# EAGLE design MK12 (EAGLE 9.0.1)

## Sheet 1 of 2
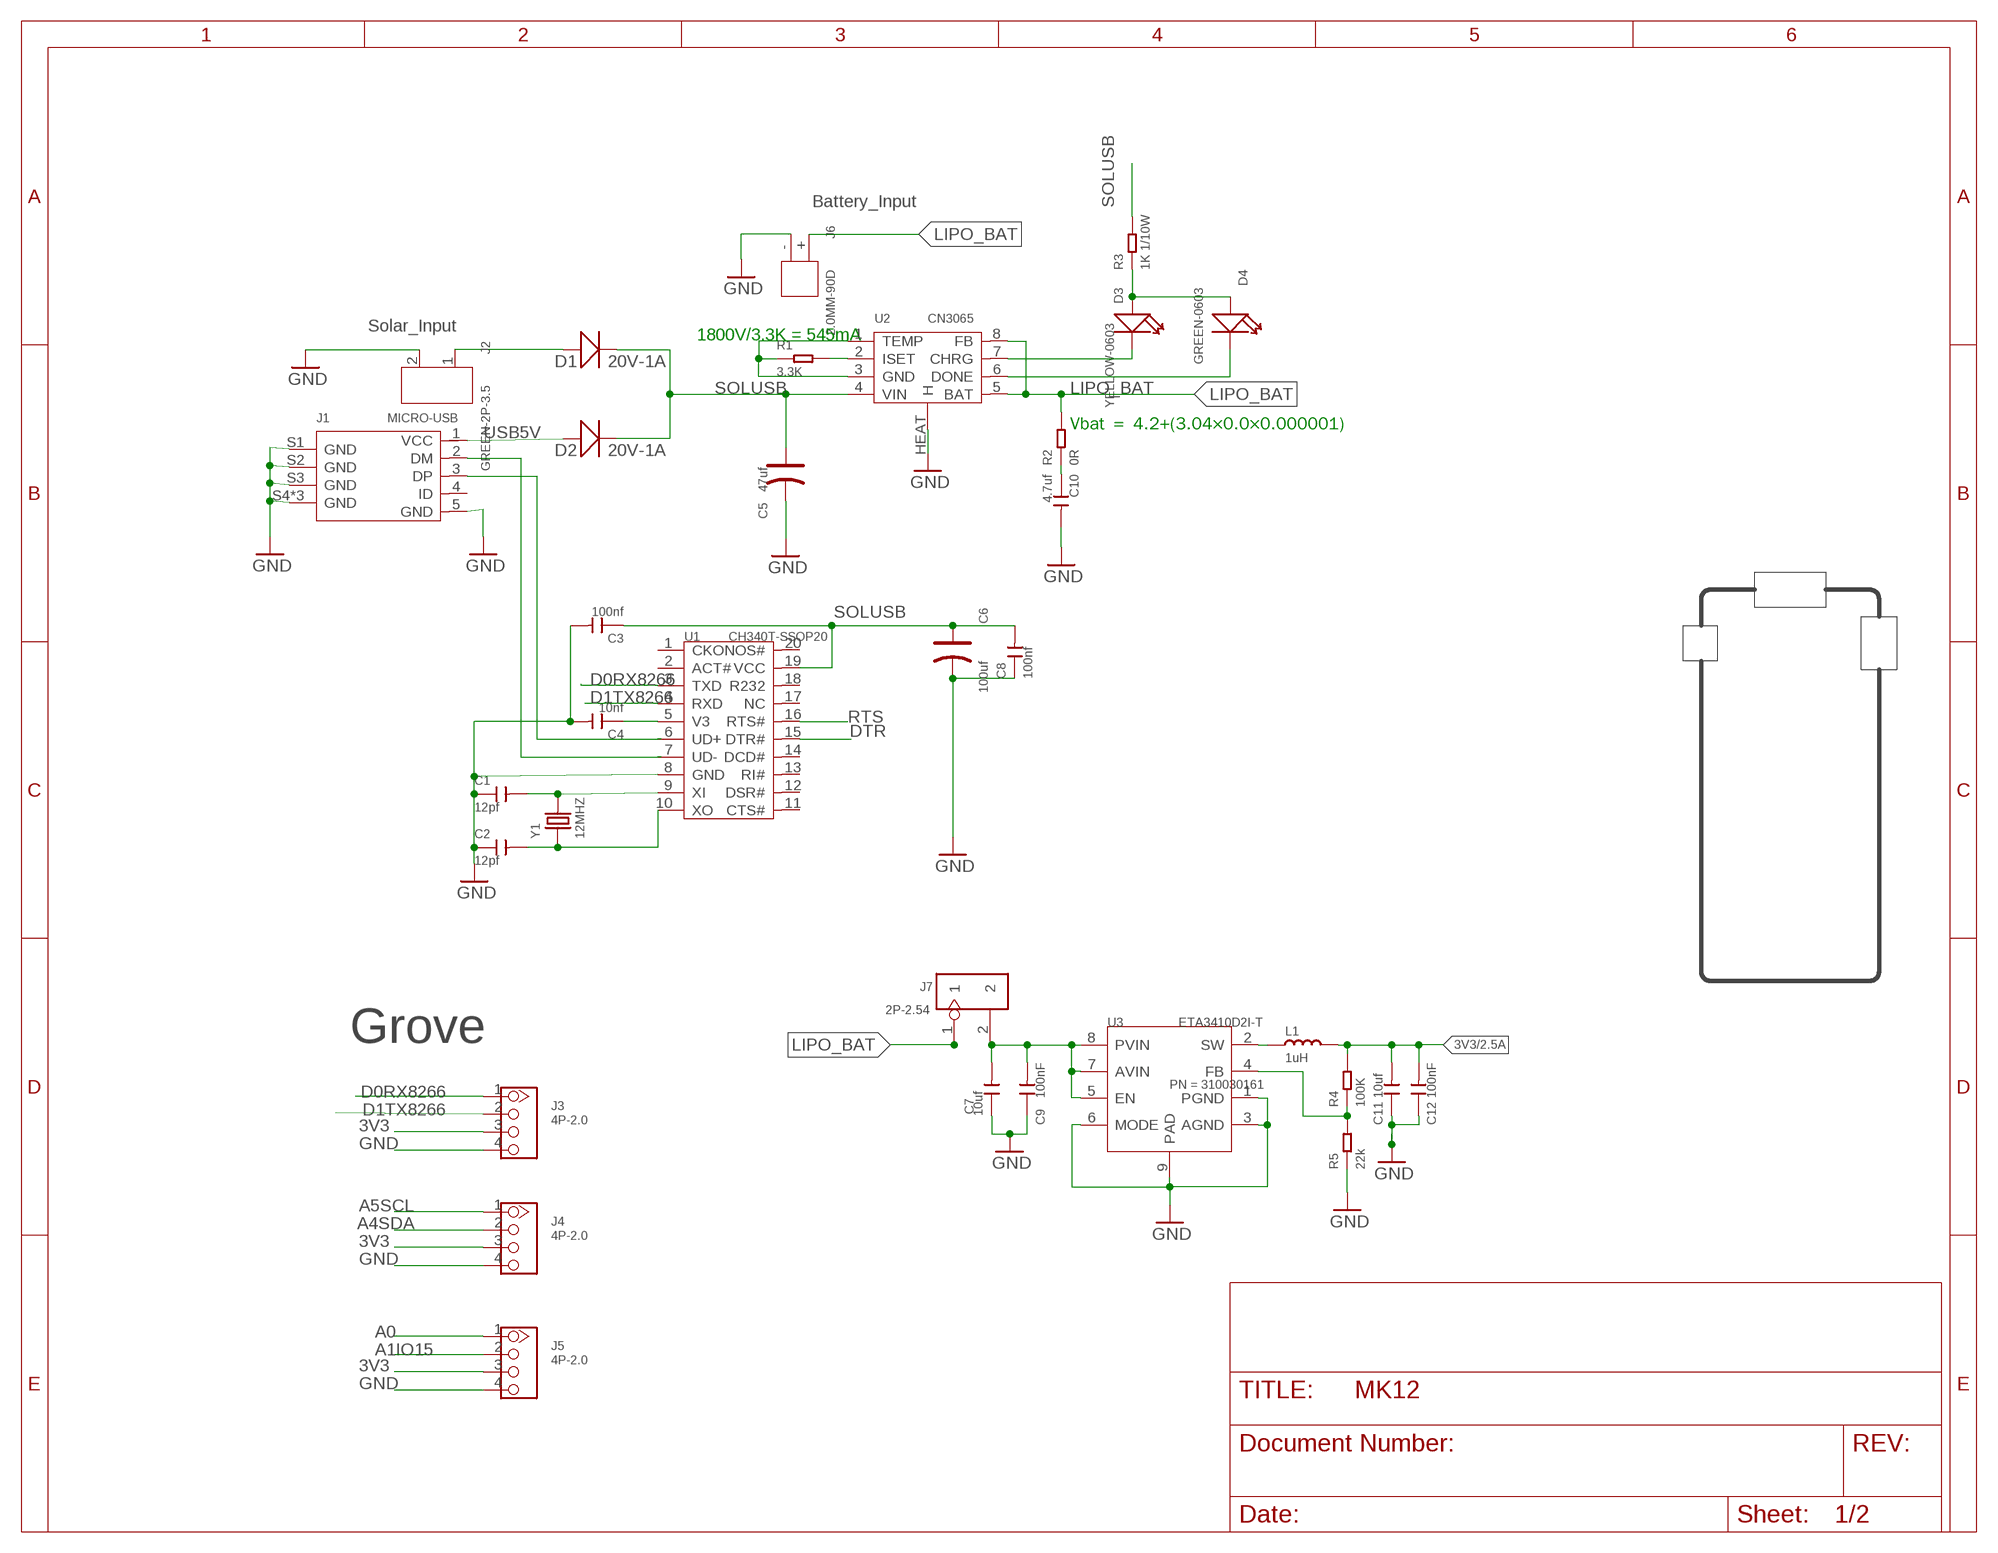
[diagram p0: schematic, sheet 1]

### Parts
C1  12pf  CERAMIC-12PF-50V-5%-NPO(0402)  [C0402]
C2  12pf  CERAMIC-12PF-50V-5%-NPO(0402)  [C0402]
C3  100nf  CERAMIC-100NF-50V-10%-X7R(0603)  [C0603]
C4  10nf  CERAMIC-10NF-50V-10%-X7R(0603)  [C0603]
C5  47uf  TANTALUM-SMD-47UF-6.3V(AVX-A)  [AVX-A]
C6  100uf  TANTALUM-SMD-100UF-10V(AVX-B)  [AVX-B]
C7  10uf  CERAMIC-10UF-25V-10%-X5R(0805)  [C0805]
C8  100nf  CERAMIC-100NF-50V-10%-X7R(0603)  [C0603]
C9  100nF  CAP-0402  [C0402]
C10  4.7uf  CERAMIC-4.7UF-10V-10%-X5R(0603)  [C0603]
C11  10uf  CERAMIC-10UF-25V-10%-X5R(0805)  [C0805]
C12  100nF  CAP-0402  [C0402]
D1  20V-1A  SMD-DIODE-SCHOTTKY-20V-1A(SOD-123)  [SOD-123]
D2  20V-1A  SMD-DIODE-SCHOTTKY-20V-1A(SOD-123)  [SOD-123]
D3  YELLOW-0603  SMD-LED-CLEAR-YELLOW(0603)  [LED-0603]
D4  GREEN-0603  SMD-LED-CLEAR-GREEN(0603)  [LED-0603]
J1  MICRO-USB  MICRO-USB5+4P'5+4P'  [MICRO-USB5+4P-SMD-0.65-B]
J2  GREEN-2P-3.5  SCREW-TERMINAL-GREEN(2P-3.5)  [H2-3.5-7.0X7.0MM]
J3  4P-2.0  GROVE-CONNECTOR-DIP(4P-2.0)  [HW4-2.0]
J4  4P-2.0  GROVE-CONNECTOR-DIP(4P-2.0)  [HW4-2.0]
J5  4P-2.0  GROVE-CONNECTOR-DIP(4P-2.0)  [HW4-2.0]
J6  2.0MM-90D  CONN-HEADER-PH-SIDE-(2P-2.0MM)'90D'  [H2-2.0-90D]
J7  2P-2.54  DIP-WHITE-MALE-HEADER-VERT(2P-2.54)  [H2-2.54]
L1  1uH  INDUCTOR/FERRITE-BEAD'0603'  [L0603]
R1  3.3K  SMD-RES-3.3K-5%-1/10W(0603)  [R0603]
R2  0R  SMD-RES-0R-5%-1/10W(0603)  [R0603]
R3  1K 1/10W  SMD-RES-1K-5%-1/10W(0603)  [R0603]
R4  100K  SMD-RES-100K-1%-1/16W(0402)  [R0402]
R5  22k  SMD-RES-22K-1%-1/16W(0402)  [R0402]
U1  CH340T-SSOP20  INTERFACE-CH340T(SSOP20)  [SSOP20-0.65-7.6X5.2MM]
U2  CN3065  PMIC-CN3065-DFN8  [DFN-8]
U3  ETA3410D2I-T  CONVERTER-ETA3410  [DFN8G-0.5-2X2MM]
Y1  12MHZ  SMD-CRYSTAL-12MHZ-20PF-20PPM-40R(2P-5.0X3.2MM)  [X2-SMD-5.0X3.2X1.3MM]

### Nets
3V3 [POWER]: C11.2 C12.2 J3.3 J4.3 J5.3 L1.2 R4.2 ; also sheet 2
A0: J5.1 ; also sheet 2
A1IO15: J5.2 ; also sheet 2
A4SDA: J4.2 ; also sheet 2
A5SCL: J4.1 ; also sheet 2
BAT_3V3_IN [POWER]: C7.2 C9.2 J7.2 U3.5(EN) U3.7(AVIN) U3.8(PVIN)
D0RX8266: J3.1 U1.3(TXD) ; also sheet 2
D1TX8266: J3.2 U1.4(RXD) ; also sheet 2
DTR: U1.15(DTR#) ; also sheet 2
GND [POWER]: C1.1 C2.1 C3.2 C4.2 C5.- C6.- C7.1 C8.1 C9.1 C10.2 C11.1 C12.1 J1.5(GND) J1.S1(GND) J1.S2(GND) J1.S3(GND) J1.S4(GND) J1.S5(GND) J1.S6(GND) J2.2 J3.4 J4.4 J5.4 J6.- R1.1 R5.1 U1.8(GND) U2.1(TEMP) U2.3(GND) U2.HEAT(H) U3.1(PGND) U3.3(AGND) U3.6(MODE) U3.9(PAD) ; also sheet 2
LIPO_BAT [POWER]: J6.+ J7.1 R2.2 U2.5(BAT) U2.8(FB)
N$2: D3.+ D4.+ R3.1
N$3: L1.1 U3.2(SW)
N$4: R4.1 R5.2 U3.4(FB)
N$5 [POWER]: C1.2 U1.9(XI) Y1.2
N$6 [POWER]: C2.2 U1.10(XO) Y1.1
N$7: R1.2 U2.2(ISET)
N$8: D3.- U2.7(CHRG)
N$9: J1.2(DM) U1.7(UD-)
N$10: C10.1 R2.1
N$11: J1.3(DP) U1.6(UD+)
N$12: D4.- U2.6(DONE)
RTS: U1.16(RTS#) ; also sheet 2
SOLAR [VUSB]: D1.+ J2.1
SOLUSB [POWER]: C3.1 C5.+ C6.+ C8.2 D1.- D2.- R3.2 U1.19(VCC) U2.4(VIN)
USB5V [VUSB]: D2.+ J1.1(VCC)
V3: C4.1 U1.5(V3)
Unconnected: J1.4(ID) U1.1(CKO) U1.2(ACT#) U1.11(CTS#) U1.12(DSR#) U1.13(RI#) U1.14(DCD#) U1.17(NC) U1.18(R232) U1.20(NOS#)

### Notes on the sheet
- Battery_Input
- Solar_Input
- 1800V/3.3K = 545mA
- Vbat ＝ 4.2+(3.04×0.0×0.000001)
- Grove

## Sheet 2 of 2
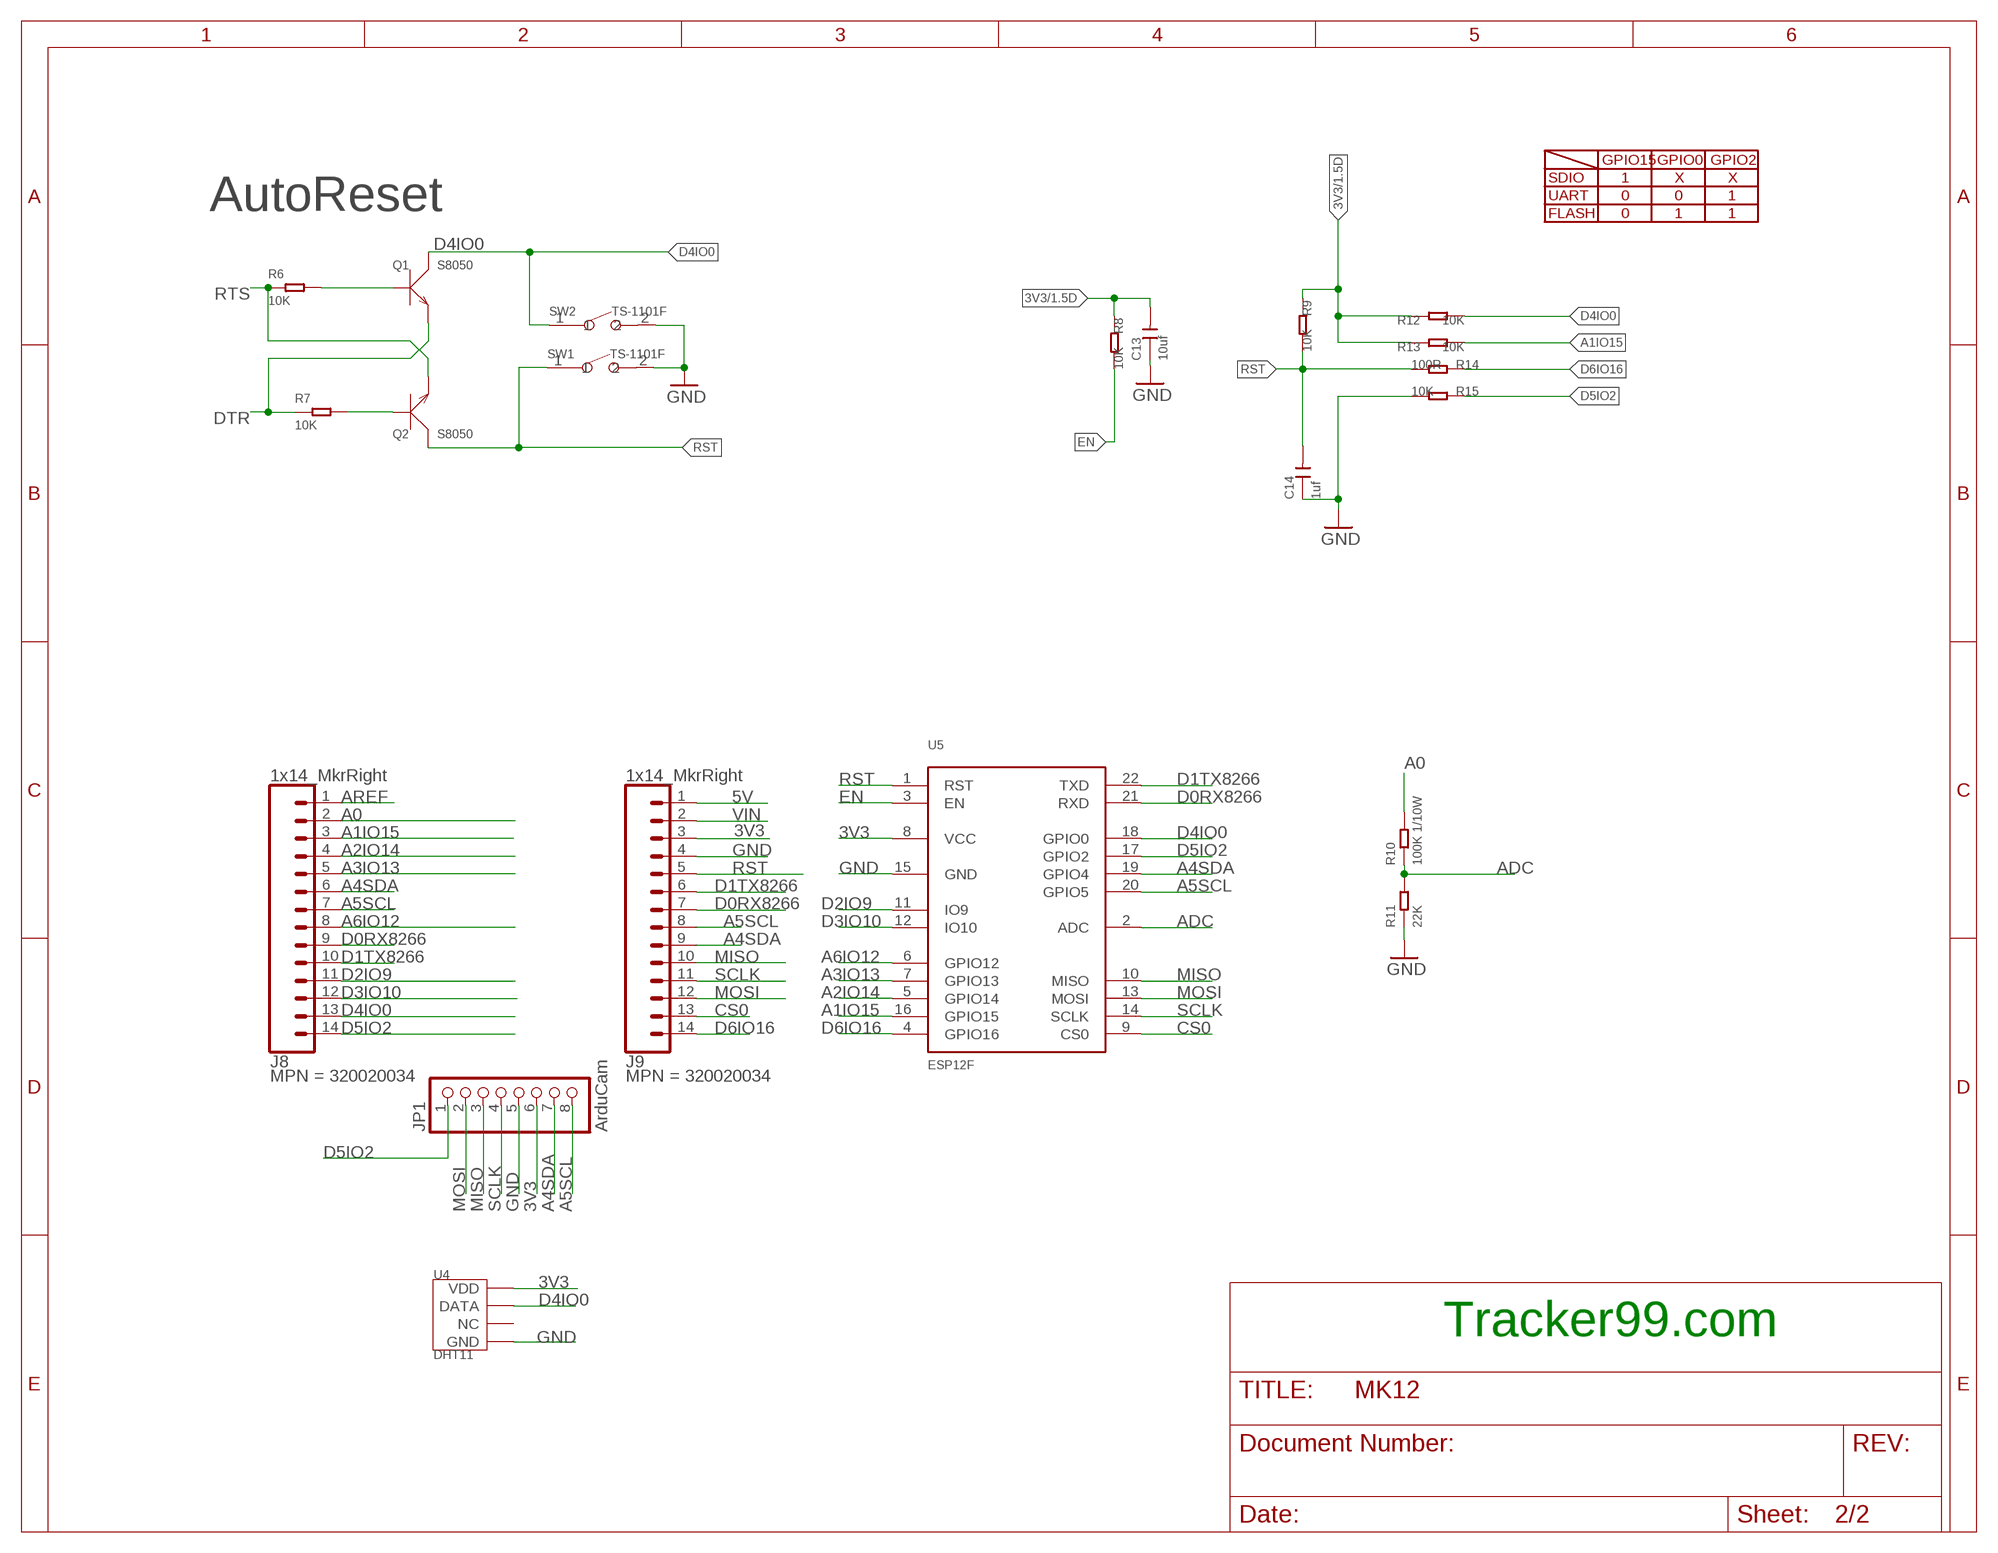
[diagram p1: schematic, sheet 2]

### Parts
C13  10uf  CERAMIC-10UF-10V-10%-X5R(0603)  [C0603]
C14  1uf  CERAMIC-1UF-25V-10%-X7R(0603)  [C0603]
J8  1x14_MkrRight  CONN_14LOCK  [1X14_LOCK]
J9  1x14_MkrRight  CONN_14LOCK  [1X14_LOCK]
JP1  ArduCam  MILLER_PINHD-1X8LOCK  [MILLER_1X08-LOCK]
Q1  S8050  SMD-TRANSISTORS-NPN-25V-500MW-S8050(SOT-23)  [SOT-23]
Q2  S8050  SMD-TRANSISTORS-NPN-25V-500MW-S8050(SOT-23)  [SOT-23]
R6  10K  SMD-RES-10K-5%-1/(0402)  [R0402]
R7  10K  SMD-RES-10K-5%-1/(0402)  [R0402]
R8  10K  SEEED-RESISTOR_SMD-RES-10K-5%-1/(0402)  [SEEED-RESISTOR_R0402]
R9  10K  SEEED-RESISTOR_SMD-RES-10K-5%-1/(0402)  [SEEED-RESISTOR_R0402]
R10  100K 1/10W  SMD-RES-100K-5%-1/10W(0603)  [R0603]
R11  22K  SMD-RES-22K-5%-1/10W(0603)  [R0603]
R12  10K  SEEED-RESISTOR_SMD-RES-10K-5%-1/(0402)  [SEEED-RESISTOR_R0402]
R13  10K  SEEED-RESISTOR_SMD-RES-10K-5%-1/(0402)  [SEEED-RESISTOR_R0402]
R14  100R  SMD-RES-100R-5%-1/10W(0603)  [R0603]
R15  10K  SEEED-RESISTOR_SMD-RES-10K-5%-1/(0402)  [SEEED-RESISTOR_R0402]
SW1  TS-1101F  DIP-BUTTON(2P-6.0X3.0X4.3MM)-TS-1101F  [SW2-5.0-6.0X3.0X4.3MM]
SW2  TS-1101F  DIP-BUTTON(2P-6.0X3.0X4.3MM)-TS-1101F  [SW2-5.0-6.0X3.0X4.3MM]
U4  DHT11  TEM-HUM-DHT11(4P-15.5X12.0MM)  [SNR4-2.54-15.5X12.0X5.5MM]
U5  ESP12F  ESP-12F  [ESP-12F]

### Nets
3V3 [POWER]: C13.2 J9.3 JP1.6 R8.1 R9.1 R12.1 R13.1 U4.1(VDD) U5.8(VCC) ; also sheet 1
5V [POWER]: J9.1
A0: J8.2 R10.2 ; also sheet 1
A1IO15: J8.3 R13.2 U5.16(GPIO15) ; also sheet 1
A2IO14: J8.4 U5.5(GPIO14)
A3IO13: J8.5 U5.7(GPIO13)
A4SDA: J8.6 J9.9 JP1.7 U5.19(GPIO4) ; also sheet 1
A5SCL: J8.7 J9.8 JP1.8 U5.20(GPIO5) ; also sheet 1
A6IO12: J8.8 U5.6(GPIO12)
ADC: R10.1 R11.2 U5.2(ADC)
AREF: J8.1
CS0: J9.13 U5.9(CS0)
D0RX8266: J8.9 J9.7 U5.21(RXD) ; also sheet 1
D1TX8266: J8.10 J9.6 U5.22(TXD) ; also sheet 1
D2IO9: J8.11 U5.11(IO9)
D3IO10: J8.12 U5.12(IO10)
D4IO0: J8.13 Q1.3(C) R12.2 SW2.1 U4.2(DATA) U5.18(GPIO0)
D5IO2: J8.14 JP1.1 R15.1 U5.17(GPIO2)
D6IO16: J9.14 R14.1 U5.4(GPIO16)
DTR: Q1.2(E) R7.1 ; also sheet 1
EN: R8.2 U5.3(EN)
GND [POWER]: C13.1 C14.1 J9.4 JP1.5 R11.1 R15.2 SW1.2 SW2.2 U4.4(GND) U5.15(GND) ; also sheet 1
MISO: J9.10 JP1.3 U5.10(MISO)
MOSI: J9.12 JP1.2 U5.13(MOSI)
N$14: Q2.1(B) R7.2
N$15: Q1.1(B) R6.2
RST: C14.2 J9.5 Q2.3(C) R9.2 R14.2 SW1.1 U5.1(RST)
RTS: Q2.2(E) R6.1 ; also sheet 1
SCLK: J9.11 JP1.4 U5.14(SCLK)
VIN: J9.2
Unconnected: U4.3(NC)

### Notes on the sheet
- GPIO15 | GPIO0 | GPIO2
- SDIO | 1 | X | X
- UART | 0 | 0 | 1
- AutoReset
- FLASH | 0 | 1 | 1
- Tracker99.com

## Library data of the parts
C1 C2 = Seeed-Capacitor:CERAMIC-12PF-50V-5%-NPO(0402): 302010049; MPN: CC0402JRNPO9BN120
C3 C8 = Seeed-Capacitor:CERAMIC-100NF-50V-10%-X7R(0603): 302010138; MPN: CC0603KRX7R9BB104
C4 = Seeed-Capacitor:CERAMIC-10NF-50V-10%-X7R(0603): 302010140; MPN: CC0603KRX7R9BB103
C5 = Seeed-Capacitor:TANTALUM-SMD-47UF-6.3V(AVX-A): 302020005; MPN: TAJA476*006#NJ
C6 = Seeed-Capacitor:TANTALUM-SMD-100UF-10V(AVX-B): 302020015; MPN: TAJB107M010#NJ
C7 C11 = Seeed-Capacitor:CERAMIC-10UF-25V-10%-X5R(0805): 302010178; MPN: CC0805KKX5R8BB106; PN: 302010178
C9 C12 = Discrete-new:CAP: Ceramic Capacitors; PN: 302010004
C10 = Seeed-Capacitor:CERAMIC-4.7UF-10V-10%-X5R(0603): 302010111; MPN: CC0603KRX5R6BB475
C13 = Seeed-Capacitor:CERAMIC-10UF-10V-10%-X5R(0603): 302010103; MPN: CC0603KRX5R6BB106
C14 = Seeed-Capacitor:CERAMIC-1UF-25V-10%-X7R(0603): 302010139; MPN: CC0603KRX7R8BB105
D1 D2 = Seeed-OPL-2017-01-Diode-james:SMD-DIODE-SCHOTTKY-20V-1A(SOD-123): 304020034; MPN: B5819W
D3 = Seeed-LED:SMD-LED-CLEAR-YELLOW(0603): 304090044; MPN: 19-217-Y5C-AM1N1VY-3T
D4 = Seeed-LED:SMD-LED-CLEAR-GREEN(0603): 304090043; MPN: 19-217-G7C-AN1P2-3T
J1 = Connector-new:MICRO-USB5+4P: 5+4P-SMD-0.65-B:320010000;5+2P-SMD-0.65-AB:340032001; EAGLEUP: USB-MICROB;2.54mm
J2 = Seeed-Connector:SCREW-TERMINAL-GREEN(2P-3.5): 320110028
J3-J5 = Seeed-Connector:GROVE-CONNECTOR-DIP(4P-2.0): 320110033
J6 = Seeed-Connector:CONN-HEADER-PH-SIDE-(2P-2.0MM): 320110027
J7 = Seeed-Connector:DIP-WHITE-MALE-HEADER-VERT(2P-2.54): 320020037; MPN: P125-1102A0BS116A3
J8 J9 = SparkFun-Connectors:CONN_14: Multi connection point. Often used as Generic Header-pin footprint for 0.1 inch spaced/style header connections On any of the 0.1 inch spaced packages, you can populate with these: Break Away Headers - Straight <https://www.sparkfun.com/products/116> (PRT-00116) Break Away Male Headers - Right Angle <https://www.sparkfun.com/products/553> (PRT-00553) Female Headers <https://www.sparkfun.com/products/115> (PRT-00115) Break Away Headers - Machine Pin <https://www.sparkfun.com/products/117> (PRT-00117) Break Away Female Headers - Swiss Machine Pin <https://www.sparkfun.com/products/743> (PRT-00743) For SCREWTERMINALS and SPRING TERMINALS visit here: Screw Terimnals on SparkFun.com <https://www.sparkfun.com/search/results?term=Screw+Terminals> (5mm/3.5mm/2.54mm spacing) This device is also useful as a general connection point to wire up your design to another part of your project. Our various solder wires solder well into these plated through hole pads. Hook-Up Wire - Assortment (Stranded, 22 AWG) <https://www.sparkfun.com/products/11375> (PRT-11375) Hook-Up Wire - Assortment (Solid Core, 22 AWG) <https://www.sparkfun.com/products/11367> (PRT-11367) View the entire wire category on our website here <https://www.sparkfun.com/categories/141> Special notes: Molex polarized connector foot print use with SKU : PRT-08231 with associated crimp pins and housings. 1MM SMD Version SKU: PRT-10208 NOTES ON THE VARIANTS LOCK and LOCK_LONGPADS... This footprint was designed to help hold the alignment of a through-hole component (i.e. 6-pin header) while soldering it into place. You may notice that each hole has been shifted either up or down by 0.005 of an inch from it's more standard position (which is a perfectly straight line). This slight alteration caused the pins (the squares in the middle) to touch the edges of the holes. Because they are alternating, it causes a "brace" to hold the component in place. 0.005 has proven to be the perfect amount of "off-center" position when using our standard breakaway headers. Although looks a little odd when you look at the bare footprint, once you have a header in there, the alteration is very hard to notice. Also,if you push a header all the way into place, it is covered up entirely on the bottom side.; MPN: 320020034
JP1 = MKR12FUNO99:MILLER_PINHD-1X8: PIN HEADER
L1 = Discrete-new:INDUCTOR/FERRITE-BEAD; PN: 303010110
Q1 Q2 = Seeed-Transistor:SMD-TRANSISTORS-NPN-25V-500MW-S8050(SOT-23): 305010017; MPN: S8050
R1 = Seeed-Resistor:SMD-RES-3.3K-5%-1/10W(0603): 301010112
R2 = Seeed-Resistor:SMD-RES-0R-5%-1/10W(0603): 301010292; MPN: RC0603JR-070RL
R3 = Seeed-Resistor:SMD-RES-1K-5%-1/10W(0603): 301010291; MPN: RC0603JR-071KL
R4 = Seeed-Resistor:SMD-RES-100K-1%-1/16W(0402): 301010456; MPN: RC0402FR-07100KL; PN: 301010666
R5 = Seeed-Resistor:SMD-RES-22K-1%-1/16W(0402); MPN: RC0402FR-0722KL
R6 R7 = Seeed-Resistor:SMD-RES-10K-5%-1/(0402): 301010004; MPN: RC0402JR-0710KL
R8 R9 R12 R13 R15 = R3Mkr12F_Solar:SEEED-RESISTOR_SMD-RES-10K-5%-1/(0402): 301010004; MPN: RC0402JR-0710KL
R10 = Seeed-Resistor:SMD-RES-100K-5%-1/10W(0603): 301010089; MPN: RC0603JR-07100KL; PN: 301010666
R11 = Seeed-Resistor:SMD-RES-22K-5%-1/10W(0603): 301010132; MPN: RC0603JR-0722KL
R14 = Seeed-Resistor:SMD-RES-100R-5%-1/10W(0603): 301010090; MPN: RC0603JR-07100RL
SW1 SW2 = Seeed-Switch:DIP-BUTTON(2P-6.0X3.0X4.3MM): 311020025; MPN: TS-1101F
U1 = Seeed-IC:INTERFACE-CH340T(SSOP20): 310070026; MPN: CH340T
U2 = IC-new:PMIC-CN3065: 310030101
U3 = template:CONVERTER-ETA3410: 3MHZ 2A High Step-Down Converter in DFN2x2-8L Package; PN: 310030161
U4 = Seeed-Sensor:TEM-HUM-DHT11(4P-15.5X12.0MM): 314010000; MPN: DHT11
U5 = Seeed-OPL-2017-01-Sensor-camilo:ESP-12F: 317060163
Y1 = Seeed-Crystal Oscillator:SMD-CRYSTAL-12MHZ-20PF-20PPM-40R(2P-5.0X3.2MM): 306010047; MPN: 5032/2P

## Net classes
0 default: width 0.152 mm, drill 0.152 mm, clearance 0.152 mm
1 POWER: width 0.305 mm, clearance 0.152 mm
2 VUSB: width 0.305 mm, clearance 0.203 mm

## Board
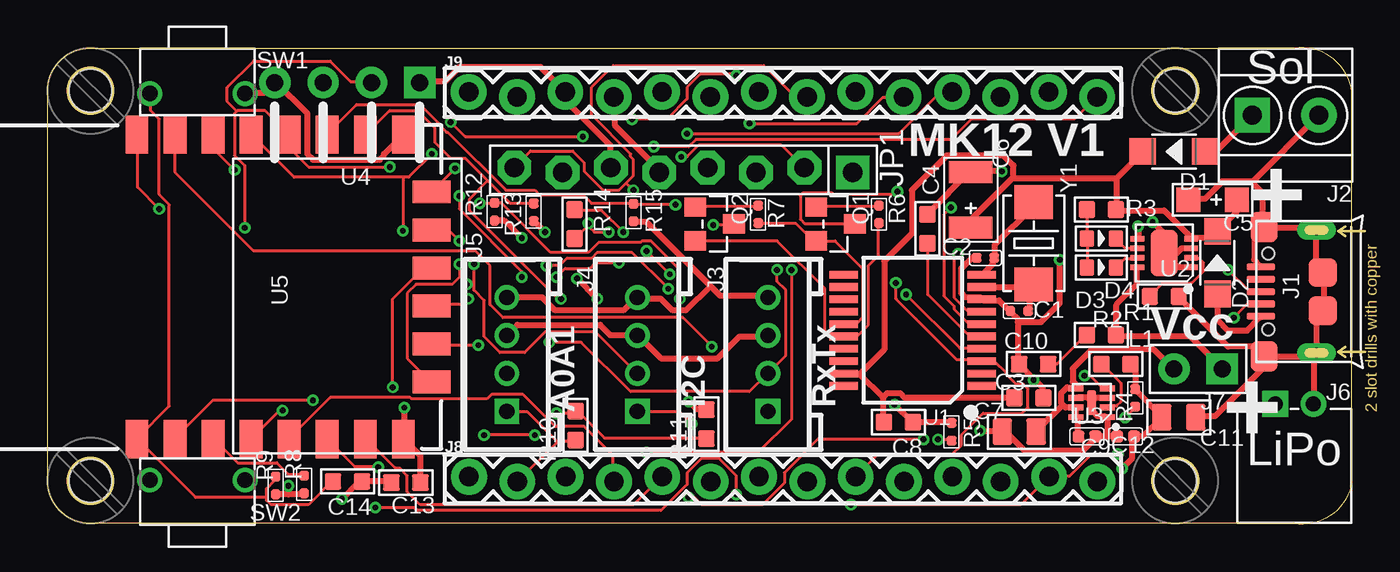
[diagram p2: board, top side]
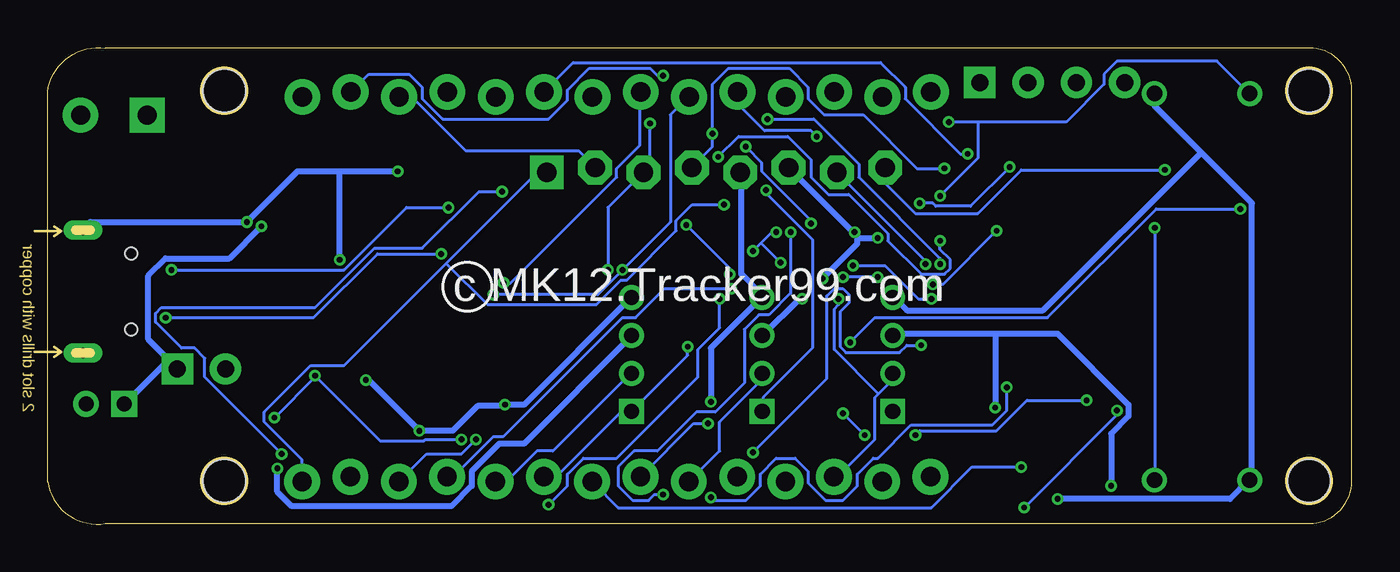
[diagram p3: board, bottom side, seen from below]

Size 68.54 x 25.05 mm. Coordinates in mm from the lower left corner, seen from the top.
Outline: 0,2.28 0,22.78 arc-90 2.25,25.03 65.5,25.03 arc-90 68.54,22.73 68.54,2.23 arc-90 65.5,0.03 2.25,0.03 arc-90 0,2.28
Copper layers (1*16): Top 0.035mm / dielectric 1.5mm / Bottom 0.035mm
Design rules "SeeedStudio_2layer_DRU_no_angle_20140221 *": minimum track width 6mil, minimum drill 12mil, track to track 6mil, track to pad 6mil, pad to pad 6mil, via to via 6mil, smd to smd 0mil, copper to edge 10mil, drill to drill 10mil, minimum pad ring 10mil, minimum via ring 6mil, stop-mask expansion 2mil, vias tented up to drill 100mil, thermal gap 10mil
Holes 2.25 mm at 2.25,2.28 59.25,2.28 59.25,22.78 2.25,22.78
tRestrict: area 0,0.1 to 4.5,4.5; area 0,20.6 to 4.5,25; area 57,20.6 to 61.5,25; area 57,0.1 to 61.5,4.5; area 0,4.4 to 4.1,20.4; area 10.7,24.4 to 57.9,25.4; area 10.2,-0.5 to 57.4,0.5; 26 lines
bRestrict: area 0,0.1 to 4.5,4.5; area 0,20.6 to 4.5,25; area 57,0.1 to 61.5,4.5; area 57,20.6 to 61.5,25; area 0,4.4 to 4.1,20.4; area 10.7,24.4 to 57.9,25.4; area 10.7,-0.5 to 57.4,0.5; 25 lines

### Footprints (pad centres in the part's own frame; a part is rotated, then mirrored left to right if it is on the bottom)
C0402 = smd 0.5 x 0.5: 1 0,0.463; 2 0,-0.463
C0603 = smd 0.889 x 0.889: 1 0,0.762; 2 0,-0.762
AVX-A = smd 1.27 x 1.27: + -1.27,0; - 1.27,0
AVX-B = smd 1.143 x 2.286: + -1.46,0; - 1.46,0
C0805 = smd 1.397 x 1.016: 1 0,0.889; 2 0,-0.889
C0402' = smd 0.635 x 0.635: 1 0,0.445; 2 0,-0.445
SOD-123 = smd 1.397 x 1.397: + -1.651,0; - 1.651,0
LED-0603 = smd 0.762 x 0.889: + -0.762,0; - 0.762,0
MICRO-USB5+4P-SMD-0.65-B = smd 0.381 x 1.524: 1 -1.3,-0.25; 2 -0.65,-0.25; 3 0,-0.25; 4 0.65,-0.25; 5 1.3,-0.25 | smd 1.6 x 1.397: S1 -3.4,-0.427; S6 3.4,-0.427 | drill 0.508 pad 1.016 long: S2 -3.226,-3.175; S5 3.226,-3.175 | smd 1.5 x 1.5: S3 -1,-3.5; S4 1,-3.5 | hole 0.635: -2,-0.65; 2,-0.65
H2-3.5-7.0X7.0MM = drill 1 pad 1.85 square: 1 -1.75,0 | drill 1 pad 1.85: 2 1.75,0
HW4-2.0 = drill 0.8 pad 1.27 square: 1 -3,0 | drill 0.8 pad 1.27: 2 -1,0; 3 1,0; 4 3,0
H2-2.0-90D = drill 0.8 pad 1.35 square: + -1,3.25 | drill 0.8 pad 1.35: - 1,3.25
H2-2.54 = drill 0.889 pad 1.651 square: 1 0,1.27 | drill 0.889 pad 1.651: 2 0,-1.27
1X14_LOCK = drill 1.016 pad 1.88: 1 0,0.127; 2 2.54,-0.127; 3 5.08,0.127; 4 7.62,-0.127; 5 10.16,0.127; 6 12.7,-0.127; 7 15.24,0.127; 8 17.78,-0.127; 9 20.32,0.127; 10 22.86,-0.127; 11 25.4,0.127; 12 27.94,-0.127; 13 30.48,0.127; 14 33.02,-0.127
MILLER_1X08-LOCK = drill 1.016 pad 1.778 square: 1 -8.89,0.127 | drill 1.016 pad 1.778 octagon: 2 -6.35,-0.127; 3 -3.81,0.127; 4 -1.27,-0.127; 5 1.27,0.127; 6 3.81,-0.127; 7 6.35,0.127; 8 8.89,-0.127
L0603 = smd 0.889 x 0.889: 1 -0.762,0; 2 0.762,0
SOT-23 = smd 1.016 x 1.143: 1 -0.889,-1.016; 2 0.889,-1.016; 3 0,1.016
R0603 = smd 0.889 x 0.889: 1 0,0.762; 2 0,-0.762
R0402 = smd 0.5 x 0.5: 1 0,0.463; 2 0,-0.463
SEEED-RESISTOR_R0402 = smd 0.5 x 0.5: 1 0,0.463; 2 0,-0.463
SW2-5.0-6.0X3.0X4.3MM = drill 0.8 pad 1.27: 1 -2.5,0; 2 2.5,0
SSOP20-0.65-7.6X5.2MM = smd 0.4 x 1.5: 1 -2.925,-3.625; 2 -2.275,-3.625; 3 -1.625,-3.625; 4 -0.975,-3.625; 5 -0.325,-3.625; 6 0.325,-3.625; 7 0.975,-3.625; 8 1.625,-3.625; 9 2.275,-3.625; 10 2.925,-3.625; 11 2.925,3.625; 12 2.275,3.625; 13 1.625,3.625; 14 0.975,3.625; 15 0.325,3.625; 16 -0.325,3.625; 17 -0.975,3.625; 18 -1.625,3.625; 19 -2.275,3.625; 20 -2.925,3.625
DFN-8 = smd 0.3 x 0.727: 1 -0.75,-1.413; 2 -0.25,-1.413; 3 0.25,-1.413; 4 0.75,-1.413; 5 0.75,1.413; 6 0.25,1.413; 7 -0.25,1.413; 8 -0.75,1.413 | smd 2.413 x 1.397: HEAT 0,0
DFN8G-0.5-2X2MM = smd 0.8 x 0.3: 1 -0.827,0.75; 2 -0.827,0.25; 3 -0.827,-0.25; 4 -0.827,-0.75; 5 0.827,-0.75; 6 0.827,-0.25; 7 0.827,0.25; 8 0.827,0.75 | smd 0.45 x 1.3: 9 0,0
SNR4-2.54-15.5X12.0X5.5MM = drill 0.889 pad 1.651 square: 1 -11.75,3.81 | drill 0.889 pad 1.651: 2 -11.75,1.27; 3 -11.75,-1.27; 4 -11.75,-3.81
ESP-12F = smd 2 x 1.2: 1 -8,3.48; 2 -8,1.48; 3 -8,-0.52; 4 -8,-2.52; 5 -8,-4.52; 6 -8,-6.52; 7 -8,-8.52; 8 -8,-10.52; 15 8,-10.52; 16 8,-8.52; 17 8,-6.52; 18 8,-4.52; 19 8,-2.52; 20 8,-0.52; 21 8,1.48; 22 8,3.48 | smd 1.2 x 2: 9 -5,-12; 10 -3,-12; 11 -1,-12; 12 1,-12; 13 3,-12; 14 5,-12
X2-SMD-5.0X3.2X1.3MM = smd 1.778 x 2.032: 1 -2.159,0; 2 2.159,0

### Placement (x,y rotation side)
C1  51.05,11.21 90 top
C2  49.28,14 90 top
C3  51.56,6.64 90 top
C4  46.23,15.53 180 top
C5  61.21,17.05 180 top
C6  48.51,17.05 90 top
C7  51.05,4.86 90 top
C8  44.7,5.37 270 top
C9  100nF  [C0402']  54.61,4.6 270 top
C10  51.82,8.41 270 top
C11  59.44,5.62 270 top
C12  100nF  [C0402']  56.64,4.6 90 top
C13  18.83,2.19 90 top
C14  15.76,2.24 270 top
D1  59.18,19.59 180 top
D2  61.47,13.75 90 top
D3  55.37,13.49 0 top
D4  55.37,15.02 0 top
J1  63.5,12.22 90 top
J2  65.05,21.5 0 top
J3  37.85,8.92 90 top
J4  30.99,8.92 90 top
J5  24.13,8.92 90 top
J6  65.51,3.07 0 top
J7  60.45,8.16 270 top
J8  22.14,2.37 0 top
J9  22.13,22.59 0 top
JP1  33.41,18.62 180 top
L1  56.13,8.41 0 top
Q1  41.4,15.78 270 top
Q2  35.05,15.78 270 top
R1  58.67,11.97 270 top
R2  55.37,9.94 90 top
R3  55.37,16.54 90 top
R4  57.15,6.64 180 top
R5  47.5,4.86 0 top
R6  43.69,16.29 180 top
R7  37.34,16.29 180 top
R8  13.49,2.09 180 top
R9  11.99,2.03 180 top
R10  27.74,5.18 0 top
R11  34.62,5.26 0 top
R12  23.48,16.42 180 top
R13  25.55,16.4 180 top
R14  27.69,15.78 180 top
R15  30.79,16.38 0 top
SW1  7.87,22.64 0 top
SW2  7.87,2.32 180 top
U1  45.47,10.19 90 top
U2  58.67,14.26 90 top
U3  54.86,6.38 180 top
U4  15.75,11.46 270 top
U5  8.18,12.47 90 top
U$5  [MH_RND_F_2.2MM_NM]  2.25,2.28 90 top
U$6  [MH_RND_F_2.2MM_NM]  2.25,22.78 90 top
U$7  [MH_RND_F_2.2MM_NM]  59.25,22.78 90 top
U$8  [MH_RND_F_2.2MM_NM]  59.25,2.28 90 top
Y1  51.82,14.76 270 top

### Tracks (layer width: path | path; a pad name or v marks a point on that pad's centre or on a via)
3V3  (via drill 0.3)
  Top 0.305: v24.92,15.04 24,15.96 23.55,15.96 R12.1 | v26.14,15.35 25.6,15.88 R13.1 | U4.1 19.58,23.27 20.88,23.27 21.64,24.04 25.91,24.04 27.2,22.74 J9.3 27.28,22.59 27.28,22.21 29.57,19.92 29.57,18.78 JP1.6 | L1.2 56.92,8.41 57.15,8.19 R4.2 57.23,6.97 58.52,5.67 C11.2 57.53,4.6 C12.2 57,4.53 57,3.46 v56.46,2.93 | C13.2 19.58,2.24 19.58,3.61 18.75,4.45 U5.8 18.75,4.6 v18.75,6.13 | 12.65,1.56 13.41,1.56 R8.1 | 12.65,1.56 12.04,1.56 R9.1 | v12.65,2.01 12.65,1.56 | J5.3 24.16,9.94 24.69,10.47 29.03,10.47 29.57,9.94 30.94,9.94 J4.3 31.09,9.86 32.23,8.72 35.2,8.72 36.35,9.86 37.8,9.86 J3.3 | v28.88,11.84 v27.81,12.91
  Bottom 0.305: 25.91,15.04 v24.92,15.04 | 26.18,15.31 29.57,18.7 JP1.6 | 26.18,15.31 25.91,15.04 | v26.14,15.35 26.18,15.31 | v12.65,2.01 12.65,4.76 11.73,5.67 11.73,6.28 15.47,10.01 18.75,10.01 | 18.75,10.01 24,10.01 24.08,9.94 J5.3 | 18.75,10.01 v18.75,6.13 | v56.46,2.93 56.46,1.71 55.7,0.95 47.32,0.95 46.25,2.01 46.25,2.78 44.81,4.22 43.51,4.22 37.87,9.86 J3.3 | v27.81,12.91 25.98,14.74 25.98,14.97 25.91,15.04 | v28.88,11.84 29.03,11.84 30.94,9.94 J4.3
A0
  Top 0.152: 26.78,4.34 J8.2 | 26.78,4.34 26.82,4.38 27.74,4.38 R10.2 | 26.78,4.34 25.22,5.9 24.16,5.9 J5.1
A1IO15  (via drill 0.3)
  Top 0.152: 23.13,18.05 21.95,19.23 21.18,19.23 20.34,20.07 20.34,20.84 19.43,21.75 17.98,21.75 16.76,20.53 U5.16 | 23.13,18.05 24.31,16.87 25.53,16.87 R13.2 | 23.13,18.05 22.17,17.1 22.17,16.49 26.82,11.84 v26.98,11.84
  Bottom 0.152: 24.88,6.85 25.07,6.66 25.07,4.45 26.98,2.55 27.2,2.55 J8.3 | 24.88,6.85 24.16,7.58 24.16,7.88 J5.2 | v26.98,11.84 26.98,11.54 27.2,11.31 27.2,9.18 24.88,6.85
A2IO14
  Top 0.152: U5.5 12.72,4.53 14.86,6.66 19.05,6.66 19.13,6.59 23.09,6.59 23.32,6.81 24.99,6.81 26.67,5.14 28.19,5.14 29.72,3.61 29.72,2.24 J8.4
A3IO13
  Top 0.152: U5.7 16.76,4.45 18.29,2.93 18.52,2.93 18.9,2.55 18.9,1.71 19.58,1.02 30.79,1.02 32.23,2.47 J8.5
A4SDA  (via drill 0.3)
  Top 0.152: 22.4,12.61 22.4,12.3 22.94,11.77 22.94,9.86 23.77,9.02 25.07,9.02 26.14,10.09 28.8,10.09 30.94,7.96 J4.2 | 22.4,12.61 v22.4,13.67 | 18.67,18.24 18.97,18.24 v20.19,19.46 | 18.67,18.24 12.95,18.24 10.74,20.45 U5.19 | v22.02,12.61 22.4,12.61 | 18.67,18.24 v18.67,15.42
  Bottom 0.152: J4.2 31.01,7.88 31.01,7.58 33.22,5.37 33.22,3.84 34.82,2.24 J8.6 | v22.4,13.67 22.4,13.82 27.05,18.47 JP1.7 | v20.19,19.46 20.57,19.46 23.47,22.36 23.47,22.97 24.77,24.26 40.92,24.26 42.44,22.74 J9.9 | v22.02,12.61 21.49,12.61 v18.67,15.42
A5SCL  (via drill 0.3)
  Top 0.152: v33.83,5.29 33.22,5.9 31.01,5.9 J4.1 | v9.83,18.63 8.76,19.69 8.76,20.45 U5.20 | 30.4,17.94 30.02,17.56 29.18,17.56 28.19,18.55 28.19,19.01 27.58,19.62 25.38,19.62 24.54,18.78 JP1.8 | 30.4,17.94 30.79,18.32 30.79,19.16 30.63,19.31 30.63,19.46 28.57,21.52 28.57,22.97 29.72,24.11 37.64,24.11 39.24,22.51 39.85,22.51 J9.8 | 30.4,17.94 v30.79,17.56
  Bottom 0.152: v33.83,5.29 34.59,5.29 37.34,2.55 J8.7 | v9.83,18.63 17.37,18.63 19.66,16.34 22.94,16.34 24.46,17.86 24.46,18.7 JP1.8 | v30.79,17.56 30.79,17.41 28.35,14.97 28.35,9.25 30.94,6.66 30.94,5.98 J4.1
A6IO12  (via drill 0.3)
  Top 0.152: v17.37,3 16.15,3 14.71,4.45 U5.6
  Bottom 0.152: v17.37,3 19.96,3 22.1,0.87 38.56,0.87 39.85,2.17 J8.8
ADC  (via drill 0.3)
  Top 0.152: R11.2 34.59,4.53 29.26,4.53 27.81,5.98 R10.1 27.74,5.9 27.66,5.82 v26.75,5.82 | v13.95,6.51 8.69,6.51 6.71,4.53 U5.2 | v25.6,4.68 v22.94,4.68
  Bottom 0.152: v13.95,6.51 17.07,6.51 18.67,4.91 22.71,4.91 v22.94,4.68 | v26.75,5.82 v25.6,4.68
BAT_3V3_IN
  Top 0.305: C9.2 54.1,4.6 54.1,5.6 U3.8 54.03,5.75 54.03,6.13 U3.7 53.87,6.13 53.49,6.13 53.34,6.28 | 54.03,7.2 53.57,7.2 53.26,6.89 53.26,6.36 53.34,6.28 | 54.03,7.2 U3.5 | 53.34,6.28 51.97,4.91 C7.2 | 54.03,7.2 54.03,7.35 53.87,7.5 53.87,8.19 54.86,9.18 58.14,9.18 59.13,8.19 J7.2
CS0  (via drill 0.3)
  Top 0.152: v21.64,13.67 21.64,12.99 21.26,12.61 19.36,12.61 18.9,12.15 18.9,8.72 20.12,7.5 U5.9 | v30.71,21.29 32.54,21.29 33.6,22.36 33.6,22.97 34.29,23.65 36.12,23.65 v36.2,23.58
  Bottom 0.152: v21.64,13.67 21.64,13.98 25.91,18.24 25.91,18.93 28.27,21.29 v30.71,21.29 | v36.2,23.58 36.5,23.58 36.88,23.96 40.08,23.96 41.22,22.82 41.22,22.28 42.22,21.29 47.78,21.29 48.84,22.36 48.84,22.97 49.53,23.65 51.66,23.65 52.58,22.74 J9.13
D0RX8266  (via drill 0.3)
  Top 0.152: J8.9 42.52,2.55 43.66,3.69 47.55,3.69 48.01,4.15 48.01,4.68 49.15,5.82 51.21,5.82 51.51,6.13 51.51,7.12 51.28,7.35 50.9,7.35 50.37,7.88 50.37,7.96 49.76,8.57 49.15,8.57 U1.3 49.07,8.64 47.78,8.64 44.58,11.84 v44.58,12.68 | v34.9,9.33 33.38,10.85 23.93,10.85 23.24,11.54 23.24,13.6 22.48,14.36 10.82,14.36 6.71,18.47 6.71,20.45 U5.21
  Bottom 0.152: v44.58,12.68 44.2,12.68 38.63,18.24 38.63,18.7 37.41,19.92 37.41,22.66 J9.7 | v34.9,9.33 34.9,8.87 37.8,5.98 J3.1 37.87,5.9 38.41,5.9 41.76,2.55 42.44,2.55 J8.9
D1TX8266  (via drill 0.3)
  Top 0.152: v45.11,12.07 47.93,9.25 49.07,9.25 U1.4 | v5.87,16.57 4.72,17.71 4.72,20.45 U5.22 | v26.36,9.56 28.04,9.56 30.63,6.97 36.88,6.97 37.8,7.88 J3.2 37.87,7.96 38.79,8.87 38.79,12.3 38.33,12.76 v38.33,13.37
  Bottom 0.152: v45.11,12.07 39.62,12.07 v38.33,13.37 35.81,15.88 35.81,21.52 34.9,22.44 J9.6 | v5.87,16.57 10.29,16.57 16,10.85 25.07,10.85 v26.36,9.56 | J8.10 44.96,2.24 44.42,2.24 42.82,3.84 41.99,3.84 37.87,7.96 J3.2
D2IO9  (via drill 0.3)
  Top 0.152: v22.1,11.84 21.79,11.54 20.19,11.54 U5.11 | v26.21,13.6 26.9,13.6 27.28,13.98 28.57,13.98 28.88,14.28 30.71,14.28 v32.61,12.38
  Bottom 0.152: v22.1,11.84 22.78,11.84 24.54,13.6 v26.21,13.6 | v32.61,12.38 36.12,12.38 37.64,10.85 38.33,10.85 44.58,4.6 45.11,4.6 47.17,2.55 47.47,2.55 J8.11
D3IO10  (via drill 0.3)
  Top 0.152: v18.14,7.2 18.14,11.84 19.74,13.44 20.12,13.44 U5.12 | v33.68,1.4 33.98,1.4 34.37,1.02 37.57,1.02 38.71,2.17 38.71,2.7 40.46,4.45 v46.02,4.45
  Bottom 0.152: v18.14,7.2 18.14,5.98 18.9,5.21 23.16,5.21 24.92,3.46 25.15,3.46 25.98,2.62 25.98,2.01 26.75,1.25 27.66,1.25 28.57,2.17 28.57,2.78 29.26,3.46 30.25,3.46 31.09,2.62 31.09,2.01 31.85,1.25 33.53,1.25 v33.68,1.4 | v46.02,4.45 46.79,3.69 48.62,3.69 50.06,2.24 J8.12
D4IO0  (via drill 0.3)
  Top 0.152: v22.71,16.87 R12.2 23.55,16.87 23.85,16.87 26.44,14.28 28.42,14.28 28.96,14.82 31.17,14.82 31.24,14.89 31.7,14.89 33.22,13.37 v33.22,11.84 | v17.98,18.78 13.72,18.78 12.72,19.77 12.72,20.45 U5.18 12.65,20.53 11.43,21.75 9.98,21.75 9.94,21.71 | v10.36,15.58 10.36,18.85 9.83,19.39 9.83,21.6 9.94,21.71 | 9.94,21.71 9.45,22.21 9.45,22.97 10.82,24.34 14.86,24.34 15.93,23.27 16.99,23.27 U4.2 | v44.65,17.48 44.5,17.33 41.3,17.33 41.22,17.41 39.7,17.41 39.55,17.25 39.55,16.03 39.78,15.81 42.37,15.81 Q1.3 | v56.24,3.69 54.86,3.69 53.72,2.55 52.65,2.55 J8.13 52.58,2.47 51.13,1.02 v42.22,1.02
  Bottom 0.152: v22.71,16.87 22.02,16.87 21.87,16.72 20.04,16.72 v17.98,18.78 | v10.36,15.58 SW2.1 | v44.65,17.48 45.87,17.48 48.84,14.51 51.36,14.51 54.48,11.39 62.56,11.39 62.87,11.08 62.87,10.62 61.49,9.25 60.81,9.25 60.27,8.72 60.27,7.73 v56.24,3.69 | v33.22,11.84 33.22,10.32 34.37,9.18 34.37,7.73 38.63,3.46 40.39,3.46 41.22,2.62 41.22,2.01 v42.22,1.02
D5IO2  (via drill 0.3)
  Top 0.152: U5.17 14.71,20.53 16.23,22.05 19.58,22.05 20.65,20.99 20.65,20.91 20.95,20.61 21.03,20.61 24.08,17.56 25.6,17.56 25.83,17.33 28.12,17.33 28.57,16.87 30.79,16.87 R15.1 30.86,16.8 v32.99,16.8
  Bottom 0.152: 47.59,13.71 52.96,8.34 54.71,8.34 57.15,5.9 57.15,5.37 55.17,3.39 J8.14 | 47.59,13.71 42.82,18.47 42.37,18.47 JP1.1 | v32.99,16.8 34.67,16.8 35.51,15.96 35.51,15.42 38.1,12.83 38.41,12.83 39.7,11.54 45.41,11.54 47.59,13.71
D6IO16  (via drill 0.3)
  Top 0.152: v31.85,19.84 33.68,19.84 34.06,20.23 47.47,20.23 48.54,21.29 53.95,21.29 55.09,22.44 J9.14 | R14.1 27.74,15.04 28.42,15.73 v28.42,15.81 28.42,15.65 28.73,15.35 v29.49,15.35 | v12.34,5.98 12.19,5.98 10.74,4.53 U5.4 | v17.22,0.87 19.28,0.87 19.43,0.72 32.23,0.72 33.6,2.09 33.6,2.7 34.37,3.46 35.28,3.46 36.2,2.55 v36.2,1.56
  Bottom 0.152: v28.42,15.81 28.42,15.96 31.01,18.55 31.01,19.01 v31.85,19.84 | v12.34,5.98 12.34,5.75 v17.22,0.87 | v36.2,1.56 36.65,1.56 36.96,1.25 37.8,1.25 38.56,2.01 38.56,3 37.72,3.84 36.5,3.84 34.44,5.9 33.45,5.9 31.93,7.42 31.93,10.24 31.17,11.01 30.63,11.01 29.49,12.15 v29.49,15.35
DTR
  Top 0.152: R7.1 37.34,15.81 39.32,15.81 40.23,14.89 Q1.2 41.38,14.89 42.82,13.44 42.82,10.85 42.52,10.55 41.91,10.55 U1.15
EN
  Top 0.152: R8.2 13.41,2.62 12.65,2.62 12.04,3.23 9.98,3.23 8.76,4.45 U5.3
GND  (via drill 0.3)
  Top 0.305: 63.25,18.02 61.72,18.02 60.81,17.1 59.97,17.1 C5.- | 63.25,18.02 63.86,17.41 63.86,15.65 J1.S6 | J1.5 63.7,13.6 63.4,13.9 63.4,15.04 63.86,15.5 J1.S6 | J2.2 66.75,21.44 63.32,18.02 63.25,18.02 | R1.1 59.44,11.92 62.03,9.33 63.4,9.33 63.86,8.87 J1.S1 | C11.1 60.35,5.67 61.34,5.67 63.86,8.19 63.86,8.72 J1.S1 | C4.2 46.25,16.34 48.46,18.55 C6.- 48.62,18.55 v50.14,18.55 | U2.1 60.05,13.52 59.36,13.52 58.67,14.21 U2.HEAT | U2.3 60.05,14.51 59.59,14.51 59.05,13.98 U2.HEAT | J1.S2 66.67,10.78 66.98,11.08 J1.S3 67.06,11.23 67.06,13.22 J1.S4 66.98,13.37 66.67,13.67 J1.S5 66.6,15.58 64.01,15.58 J1.S6 | v58.06,15.88 58.6,15.35 58.6,14.36 U2.HEAT | J6.- 66.52,6.36 66.52,8.8 66.6,8.87 J1.S2 | J1.S1 64.08,8.8 66.45,8.8 J1.S2 | U5.15 18.67,20.45 17.68,19.46 17.68,19.39 17.45,19.16 13.95,19.16 13.64,19.46 13.64,21.6 11.96,23.27 U4.4 11.81,23.12 11.35,22.66 10.44,22.66 SW1.2 | C13.1 18.06,2.24 16.54,2.24 C14.1 16.38,2.24 v15.47,1.33 | JP1.5 32.08,18.55 32.08,18.7 29.79,20.99 29.79,22.44 J9.4 | v33.68,6.43 34.06,6.05 34.59,6.05 R11.1 | J5.4 24.16,11.92 25.98,11.92 26.67,11.23 30.25,11.23 30.94,11.92 J4.4 31.09,11.84 32.23,11.84 32.84,11.23 33.53,11.23 34.82,12.53 | 51.85,7.61 C10.2 50.98,8.49 50.98,10.62 | 51.85,7.61 52.27,7.2 52.27,6.66 C3.2 | C2.1 48.77,13.98 48.54,13.98 48.01,13.44 48.01,12.15 48.23,11.92 49,11.92 U1.8 49.15,11.77 49.99,11.77 50.52,11.23 C1.1 50.67,11.08 50.98,10.78 50.98,10.62 | U3.6 54.1,6.66 54.63,6.66 54.86,6.43 U3.9 | U3.3 55.63,6.66 55.09,6.66 54.94,6.51 U3.9 | C12.1 55.7,4.6 | 55.7,4.6 C9.1 55.09,4.53 54.41,3.84 51.36,3.84 50.37,4.83 50.22,4.83 C7.1 50.06,4.91 v49,4.91
  Top 0.305: 55.7,4.6 55.7,5.6 U3.1 55.55,5.67 55.17,5.67 54.94,5.9 54.94,6.28 U3.9 | R5.1 47.47,5.37 C8.1 45.34,5.44 v44.5,6.28 | 34.82,12.53 35.36,12 37.8,12 J3.4 | 34.82,12.53 31.47,15.88 30.86,15.88 R15.2 | v51.82,7.58 51.85,7.61 | v53.19,13.9 53.19,11.61 52.2,10.62 50.98,10.62
  Bottom 0.305: J1.S5 66.67,15.5 66.29,15.88 v58.06,15.88 55.4,18.55 53.19,18.55 | 53.19,18.55 v50.14,18.55 | v15.47,1.33 6.4,1.33 5.41,2.32 SW2.2 5.26,2.39 5.26,16.87 7.92,19.54 | 7.92,19.54 10.36,21.98 10.36,22.59 SW1.2 | v33.68,6.43 33.68,9.25 31.01,11.92 J4.4 31.01,12.07 32.08,13.14 32.08,18.47 JP1.5 | J3.4 37.87,11.92 43.51,6.28 v44.5,6.28 44.58,6.2 45.95,6.2 47.24,4.91 v49,4.91 51.66,7.58 v51.82,7.58 | 7.92,19.54 16.23,11.23 23.39,11.23 24.08,11.92 J5.4 | v53.19,13.9 53.19,18.55
LIPO_BAT  (via drill 0.3)
  Top 0.305: U2.8 57.23,13.44 57.23,12.61 56.16,11.54 56.16,9.94 R2.2 56.24,9.86 60.05,9.86 61.72,8.19 J7.1 | v57.3,15.65 57.3,15.04 U2.5
  Bottom 0.305: v57.3,15.65 58.98,13.98 62.33,13.98 63.25,13.06 63.25,9.71 61.72,8.19 J7.1 62.26,8.57 64.47,6.36 J6.+
MISO  (via drill 0.3)
  Top 0.152: v22.63,9.41 20.19,9.41 U5.10 | v31.47,3.77 37.34,3.77 39.09,5.52 v39.09,13.37 | v36.88,21.06 42.52,21.06 43.89,22.44 44.96,22.44 J9.10
  Bottom 0.152: v22.63,9.41 23.39,9.41 23.77,9.02 26.59,9.02 26.9,9.33 26.9,11.16 26.44,11.61 26.44,12.07 26.75,12.38 27.2,12.38 27.58,12 27.58,7.65 v31.47,3.77 | v39.09,13.37 39.09,16.64 37.26,18.47 JP1.3 37.19,18.55 36.88,18.85 v36.88,21.06
MOSI  (via drill 0.3)
  Top 0.152: v21.64,14.89 21.11,15.42 20.19,15.42 U5.13 | v33.3,19.31 33.6,19.31 34.21,19.92 38.56,19.92 39.7,18.78 JP1.2
  Bottom 0.152: v21.64,14.89 21.64,14.43 21.11,13.9 21.11,13.44 21.41,13.14 22.63,13.14 24.38,14.89 24.38,15.27 26.44,17.33 27.51,17.33 28.42,18.24 28.42,19.16 29.64,20.38 32.23,20.38 v33.3,19.31 | J9.12 50.06,22.44 49.38,22.44 46.56,19.62 40.62,19.62 39.78,18.78 JP1.2
N$2
  Top 0.152: D3.+ 54.63,13.52 54.63,14.97 D4.+ 54.63,15.04 54.63,16.49 R3.1
N$3
  Top 0.152: U3.2 55.7,6.2 56.16,6.2 56.39,6.43 56.39,7.42 55.4,8.41 L1.1
N$4  (via drill 0.3)
  Top 0.152: v46.79,4.45 47.47,4.45 R5.2 | v54.48,7.8 54.79,7.8 55.4,7.2 55.63,7.2 U3.4 | v56.62,5.6 57.15,6.13 R4.1
  Bottom 0.152: v46.79,4.45 48.69,4.45 48.77,4.38 51.05,4.38 v54.48,7.8 54.48,7.73 v56.62,5.6
N$5
  Top 0.305: C1.2 51.59,11.23 51.59,12.38 Y1.2 51.51,12.45 49.15,12.45 U1.9
N$6
  Top 0.305: U1.10 49.15,13.14 49.68,13.67 49.68,13.98 C2.2 49.76,14.13 49.76,14.66 51.82,16.72 Y1.1
N$7
  Top 0.152: U2.2 60.12,13.98 60.5,13.98 60.73,13.75 60.73,13.29 60.12,12.68 58.6,12.68 57.91,12 R1.2
N$8
  Top 0.152: D3.- 56.62,13.98 57.23,13.98 U2.7
N$9  (via drill 0.3)
  Top 0.152: v47.85,14.21 47.62,13.98 47.62,11.92 48.31,11.23 49.07,11.23 U1.7 | v62.33,10.85 63.02,11.54 63.7,11.54 J1.2
  Bottom 0.152: v47.85,14.21 51.21,14.21 54.56,10.85 v62.33,10.85
N$10
  Top 0.152: C10.1 53.03,8.41 54.56,9.94 R2.1
N$11  (via drill 0.3)
  Top 0.152: v47.47,16.64 47.09,16.26 47.09,12 47.62,11.46 47.62,11.31 48.39,10.55 49.07,10.55 U1.6 | v62.03,13.37 63.17,12.22 J1.3
  Bottom 0.152: v47.47,16.64 49.68,16.64 52.96,13.37 v62.03,13.37
N$12
  Top 0.152: U2.6 57.23,14.51 56.62,14.51 56.16,14.97 D4.-
N$14
  Top 0.152: R7.2 37.34,16.72 34.06,16.72 Q2.1
N$15
  Top 0.152: R6.2 43.66,16.72 40.39,16.72 Q1.1
RST  (via drill 0.3)
  Top 0.152: v30.25,15.35 29.11,16.49 27.74,16.49 R14.2 | v32.69,13.14 v31.47,14.36 | v34.98,15.73 36.04,15.73 Q2.3 | 11.51,1.4 11.51,1.25 11.73,1.02 13.72,1.02 14.94,2.24 C14.2 | 11.51,1.4 11.51,1.86 11.96,2.32 11.96,2.47 R9.2 | 11.51,1.4 7.77,1.4 4.72,4.45 U5.1 4.72,4.53 6.4,6.2 6.4,16.8 5.87,17.33 5.87,21.29 5.41,21.75 5.41,22.59 SW1.1 | v28.12,20.38 21.95,20.38 v21.18,21.14 | v30.02,13.75 28.8,13.75 28.5,13.44 27.2,13.44 v26.75,12.99 | v24.92,12.99 24.92,13.29 21.64,16.57 v21.64,17.25
  Bottom 0.152: v30.25,15.35 30.48,15.35 31.05,14.78 | v31.47,14.36 31.05,14.78 | v32.69,13.14 32.69,13.44 v34.98,15.73 | v28.12,20.38 28.42,20.68 30.86,20.68 32.23,22.05 32.23,22.66 J9.5 | 19.66,21.14 15.01,21.14 13.03,23.12 13.03,23.65 12.34,24.34 7.09,24.34 5.41,22.66 SW1.1 | 19.66,21.14 v21.18,21.14 | v30.02,13.75 31.05,14.78 | v24.92,12.99 v26.75,12.99 | v21.64,17.25 19.66,19.23 19.66,21.14
RTS
  Top 0.152: R6.1 43.66,15.81 43.66,14.13 43.13,13.6 43.13,10.47 42.6,9.94 41.91,9.94 U1.16 41.83,9.94 41.07,9.94 40.84,10.17 40.84,12.38 38.33,14.89 Q2.2
SCLK  (via drill 0.3)
  Top 0.152: v21.41,18.7 20.19,17.48 U5.14 | v33.6,20.53 44.73,20.53 46.86,22.66 47.47,22.66 J9.11
  Bottom 0.152: v21.41,18.7 22.86,18.7 25.68,21.52 27.74,21.52 28.57,22.36 28.57,22.97 29.57,23.96 32.77,23.96 33.6,23.12 v33.6,20.53 33.6,19.84 34.67,18.78 JP1.4
SOLAR
  Top 0.305: D1.+ 60.88,19.62 61.42,19.62 63.25,21.44 J2.1
SOLUSB
  Top 0.305: 43.89,6.66 43.89,5.37 C8.2 | 42.67,7.88 43.89,6.66 | 42.67,7.88 41.91,7.88 U1.19 | 43.89,6.66 44.12,6.89 44.81,6.89 45.03,6.66 50.75,6.66 C3.1 | C5.+ 62.48,16.42 D2.- 61.11,15.04 60.12,15.04 U2.4 60.05,15.12 58.67,16.49 56.24,16.49 R3.2 56.16,16.57 56.16,18.17 | 56.16,18.17 57.53,19.54 D1.- | 50.67,18.17 48.54,16.03 48.54,15.65 C6.+ | 56.16,18.17 50.67,18.17 | 42.67,7.88 43.97,9.18 43.97,13.82 45.41,15.27 45.41,17.56 47.24,19.39 50.22,19.39 50.75,18.85 50.75,18.24 50.67,18.17
USB5V
  Top 0.305: D2.+ 61.49,12.07 61.49,10.7 62.03,10.17 63.02,10.17 63.7,10.85 J1.1
V3
  Top 0.152: C4.1 46.25,14.74 46.25,12.07 48.39,9.94 49.07,9.94 U1.5

### Text on the board
tPlace: Sol | MK12 V1 | + | Vcc | A0A1 | I2C | RxTx | + | LiPo
bPlace: c MK12.Tracker99.com
test-probe: 5V | VIN(5V) | VCC | GND | RESET | 14 | 13 | 12 | 11 | 10 | 9 | 8 | 7 | 6 | USB_5V | USB_D- | SWCLK | SWDIO | JGND | JRST | VTG | BATT+ | BATT- | USB_D+ | USB_GND | AREF | A0 | A1 | A2 | A3 | A4 | A5 | A6 | 0 | 1 | 2 | 3 | 4 | 5